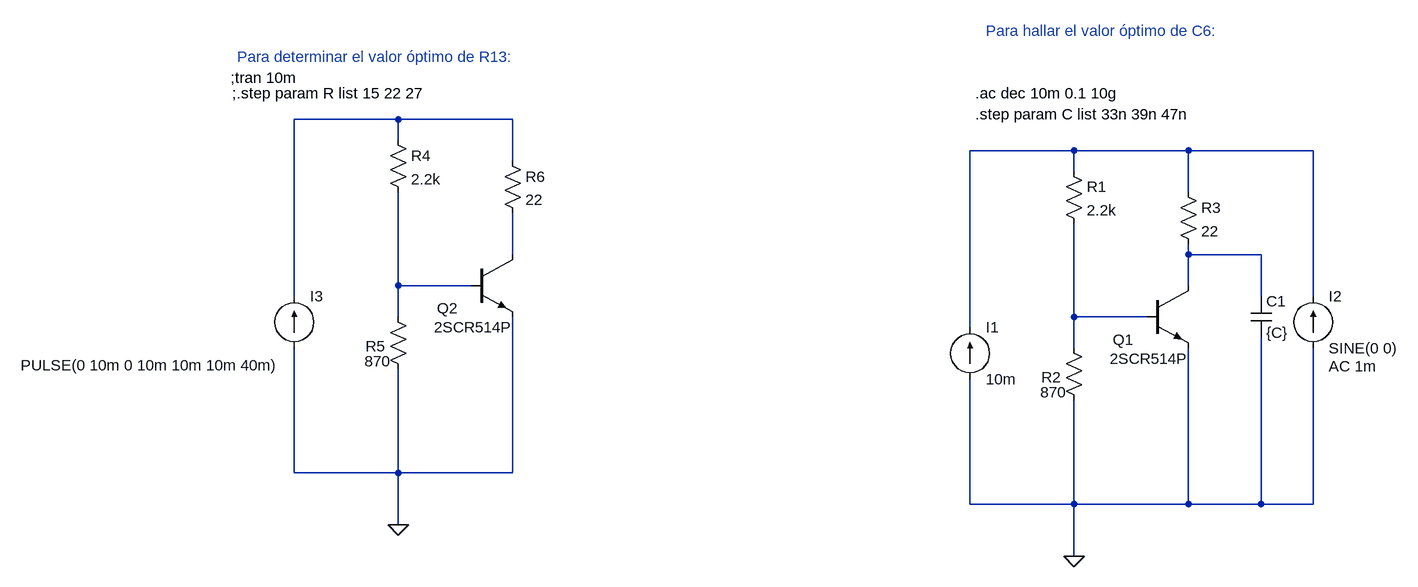
[diagram p0: schematic multiplicador_vbe_elegir_capacitor.asc]
multiplicador_vbe_elegir_capacitor.asc, the LTspice schematic file:
Version 4
SHEET 1 880 680
WIRE -1040 -176 -1200 -176
WIRE -864 -176 -1040 -176
WIRE -1040 -144 -1040 -176
WIRE 0 -128 -160 -128
WIRE 176 -128 0 -128
WIRE 368 -128 176 -128
WIRE -864 -112 -864 -176
WIRE 0 -96 0 -128
WIRE 176 -64 176 -128
WIRE -864 32 -864 -32
WIRE 176 32 176 16
WIRE 288 32 176 32
WIRE -1040 80 -1040 -64
WIRE -928 80 -1040 80
WIRE 176 80 176 32
WIRE -1200 96 -1200 -176
WIRE 288 96 288 32
WIRE 368 96 368 -128
WIRE -1040 128 -1040 80
WIRE 0 128 0 -16
WIRE 112 128 0 128
WIRE -160 144 -160 -128
WIRE 0 176 0 128
WIRE -1200 368 -1200 176
WIRE -1040 368 -1040 208
WIRE -1040 368 -1200 368
WIRE -864 368 -864 128
WIRE -864 368 -1040 368
WIRE -160 416 -160 224
WIRE 0 416 0 256
WIRE 0 416 -160 416
WIRE 176 416 176 176
WIRE 176 416 0 416
WIRE 288 416 288 160
WIRE 288 416 176 416
WIRE 368 416 368 176
WIRE 368 416 288 416
WIRE -1040 448 -1040 368
WIRE 0 496 0 416
FLAG 0 496 0
FLAG -1040 448 0
SYMBOL npn 112 80 R0
WINDOW 0 -52 83 Left 2
WINDOW 3 -57 112 Left 2
SYMATTR InstName Q1
SYMATTR Value 2SCR514P
SYMBOL res -16 -112 R0
SYMATTR InstName R1
SYMATTR Value 2.2k
SYMBOL res -16 160 R0
WINDOW 0 -34 61 Left 2
WINDOW 3 -36 84 Left 2
SYMATTR InstName R2
SYMATTR Value 870
SYMBOL res 160 -80 R0
SYMATTR InstName R3
SYMATTR Value 22
SYMBOL current -160 224 M180
WINDOW 0 24 80 Left 2
WINDOW 3 24 0 Left 2
WINDOW 123 0 0 Left 0
WINDOW 39 0 0 Left 0
SYMATTR InstName I1
SYMATTR Value 10m
SYMBOL current 368 176 M180
WINDOW 0 24 80 Left 2
WINDOW 3 24 0 Left 2
WINDOW 123 24 -28 Left 2
WINDOW 39 0 0 Left 0
SYMATTR InstName I2
SYMATTR Value SINE(0 0)
SYMATTR Value2 AC 1m
SYMBOL cap 272 96 R0
SYMATTR InstName C1
SYMATTR Value {C}
SYMBOL npn -928 32 R0
WINDOW 0 -52 83 Left 2
WINDOW 3 -57 112 Left 2
SYMATTR InstName Q2
SYMATTR Value 2SCR514P
SYMBOL res -1056 -160 R0
SYMATTR InstName R4
SYMATTR Value 2.2k
SYMBOL res -1056 112 R0
WINDOW 0 -34 61 Left 2
WINDOW 3 -36 84 Left 2
SYMATTR InstName R5
SYMATTR Value 870
SYMBOL res -880 -128 R0
SYMATTR InstName R6
SYMATTR Value 22
SYMBOL current -1200 176 M180
WINDOW 0 24 80 Left 2
WINDOW 3 -421 -26 Left 2
WINDOW 123 0 0 Left 0
WINDOW 39 0 0 Left 0
SYMATTR InstName I3
SYMATTR Value PULSE(0 10m 0 10m 10m 10m 40m)
TEXT -152 -216 Left 2 !.ac dec 10m 0.1 10g
TEXT -1296 -216 Left 2 !;.step param R list 15 22 27
TEXT -1298 -240 Left 2 !;tran 10m
TEXT -1288 -272 Left 2 ;Para determinar el valor óptimo de R13:
TEXT -136 -312 Left 2 ;Para hallar el valor óptimo de C6:
TEXT -152 -184 Left 2 !.step param C list 33n 39n 47n

The netlist it stands for:
* multiplicador_vbe_elegir_capacitor.asc
Q1 N004 N006 0 0 2SCR514P
R1 N002 N006 2.2k
R2 N006 0 870
R3 N002 N004 22
I1 0 N002 10m
I2 0 N002 SINE(0 0) AC 1m
C1 N004 0 {C}
Q2 N003 N005 0 0 2SCR514P
R4 N001 N005 2.2k
R5 N005 0 870
R6 N001 N003 22
I3 0 N001 PULSE(0 10m 0 10m 10m 10m 40m)
.model NPN NPN
.model PNP PNP
.lib standard.bjt
.ac dec 10m 0.1 10g
;.step param R list 15 22 27
;tran 10m
* Para determinar el valor óptimo de R13:
* Para hallar el valor óptimo de C6:
.step param C list 33n 39n 47n
.backanno
.end